# EAGLE design arBot-v1 (EAGLE 7.3.0)
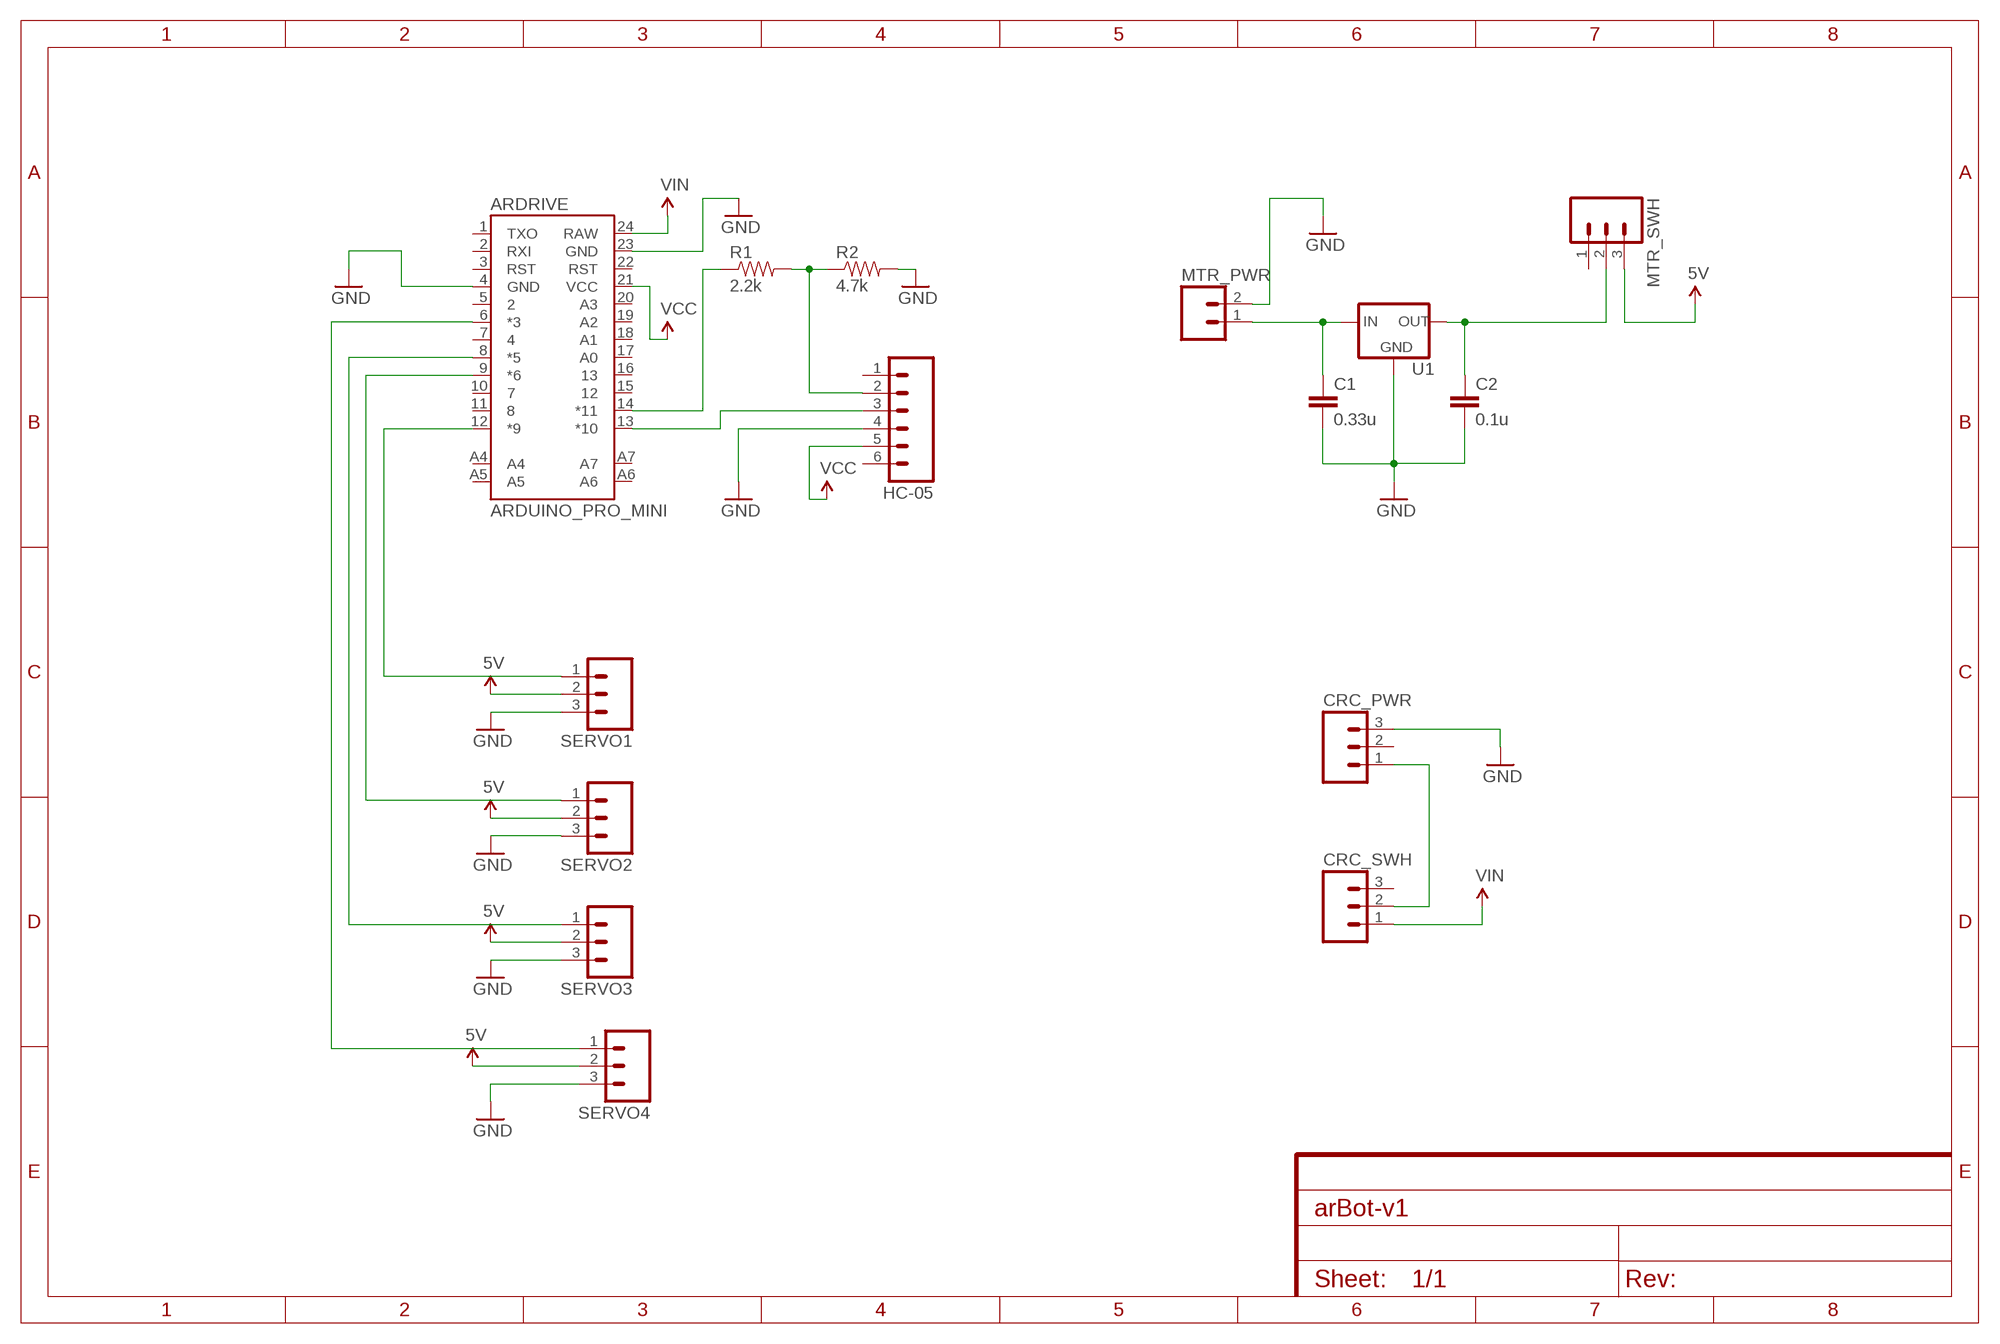
[diagram p0: schematic, sheet 1]

## Parts
ARDRIVE  ARDUINO_PRO_MINI  [ARDUINO_PRO_MINI]
C1  0.33u  CAPPTH  [CAP-PTH-SMALL]
C2  0.1u  CAPPTH  [CAP-PTH-SMALL]
CRC_PWR  M03LONGPADS  [1X03_LONGPADS]
CRC_SWH  M03LOCK_LONGPADS  [1X03_LOCK_LONGPADS]
HC-05  M06LOCK_LONGPADS  [1X06_LOCK_LONGPADS]
MTR_PWR  M025MM  [SCREWTERMINAL-5MM-2]
MTR_SWH  M03-SCREW-5MM  [SCREWTERMINAL-5MM-3]
R1  2.2k  RESISTORKIT  [AXIAL-0.3-KIT]
R2  4.7k  RESISTORKIT  [AXIAL-0.3-KIT]
SERVO1  M03LONGPADS  [1X03_LONGPADS]
SERVO2  M03LONGPADS  [1X03_LONGPADS]
SERVO3  M03LONGPADS  [1X03_LONGPADS]
SERVO4  M03LONGPADS  [1X03_LONGPADS]
U1  V_REG_78XX-TO-220  [TO-220-ALT]

## Nets
5V: MTR_SWH.3 SERVO1.2 SERVO2.2 SERVO3.2 SERVO4.2
GND: ARDRIVE.4(GND) ARDRIVE.23(GND) C1.2 C2.2 CRC_PWR.3 HC-05.4 MTR_PWR.2 R2.P$2 SERVO1.3 SERVO2.3 SERVO3.3 SERVO4.3 U1.GND
N$1: C1.1 MTR_PWR.1 U1.IN
N$2: C2.1 MTR_SWH.2 U1.OUT
N$4: CRC_PWR.1 CRC_SWH.2
N$5: ARDRIVE.13(*10) HC-05.3
N$6: ARDRIVE.14(*11) R1.P$1
N$7: HC-05.2 R1.P$2 R2.P$1
N$8: ARDRIVE.8(*5) SERVO3.1
N$9: ARDRIVE.6(*3) SERVO4.1
N$10: ARDRIVE.9(*6) SERVO2.1
N$11: ARDRIVE.12(*9) SERVO1.1
VCC: ARDRIVE.21(VCC) HC-05.5
VIN: ARDRIVE.24(RAW) CRC_SWH.1
Unconnected: ARDRIVE.1(TXO) ARDRIVE.2(RXI) ARDRIVE.3(RST) ARDRIVE.5 ARDRIVE.7 ARDRIVE.10 ARDRIVE.11 ARDRIVE.15 ARDRIVE.16 ARDRIVE.17(A0) ARDRIVE.18(A1) ARDRIVE.19(A2) ARDRIVE.20(A3) ARDRIVE.22(RST) ARDRIVE.A4 ARDRIVE.A5 ARDRIVE.A6 ARDRIVE.A7 CRC_PWR.2 CRC_SWH.3 HC-05.1 HC-05.6 MTR_SWH.1

## Library data of the parts
ARDRIVE = SparkFun-Boards:ARDUINO_PRO_MINI
C1 C2 = SparkFun-Capacitors:CAP: Capacitor Standard 0603 ceramic capacitor, and 0.1" leaded capacitor.
CRC_PWR CRC_SWH SERVO1-SERVO4 = SparkFun-Connectors:M03: Header 3 Standard 3-pin 0.1" header. Use with straight break away headers (SKU : PRT-00116), right angle break away headers (PRT-00553), swiss pins (PRT-00743), machine pins (PRT-00117), and female headers (PRT-00115). Molex polarized connector foot print use with SKU : PRT-08232 with associated crimp pins and housings.
HC-05 = SparkFun-Connectors:M06: Header 6 Standard 6-pin 0.1" header. Use with straight break away headers (SKU : PRT-00116), right angle break away headers (PRT-00553), swiss pins (PRT-00743), machine pins (PRT-00117), and female headers (PRT-00115). Molex polarized connector foot print use with SKU : PRT-08094 with associated crimp pins and housings. NOTES ON THE VARIANTS LOCK and LOCK_LONGPADS... This footprint was designed to help hold the alignment of a through-hole component (i.e. 6-pin header) while soldering it into place. You may notice that each hole has been shifted either up or down by 0.005 of an inch from it's more standard position (which is a perfectly straight line). This slight alteration caused the pins (the squares in the middle) to touch the edges of the holes. Because they are alternating, it causes a "brace" to hold the component in place. 0.005 has proven to be the perfect amount of "off-center" position when using our standard breakaway headers. Although looks a little odd when you look at the bare footprint, once you have a header in there, the alteration is very hard to notice. Also,if you push a header all the way into place, it is covered up entirely on the bottom side. This idea of altering the position of holes to aid alignment will be further integrated into the Sparkfun Library for other footprints. It can help hold any component with 3 or more connection pins.
MTR_PWR = SparkFun-Connectors:M02: Standard 2-pin 0.1" header. Use with - straight break away headers ( PRT-00116) - right angle break away headers (PRT-00553) - swiss pins (PRT-00743) - machine pins (PRT-00117) - female headers (PRT-00115) Molex polarized connector foot print use with: PRT-08233 with associated crimp pins and housings. 2.54_SCREWTERM for use with PRT-10571. 3.5mm Screw Terminal footprints for PRT-08084 5mm Screw Terminal footprints for use with PRT-08432; STOREFRONT_ID: PRT-08432
MTR_SWH = SparkFun-Connectors:M03: Header 3 Standard 3-pin 0.1" header. Use with straight break away headers (SKU : PRT-00116), right angle break away headers (PRT-00553), swiss pins (PRT-00743), machine pins (PRT-00117), and female headers (PRT-00115). Molex polarized connector foot print use with SKU : PRT-08232 with associated crimp pins and housings.; STOREFRONT_ID: PRT-08433
R1 R2 = SparkFun-Passives:RESISTOR: Resistor Basic schematic elements and footprints for 0603, 1206, and PTH resistors.
U1 = SparkFun-PowerIC:V_REG_78XX: Voltage Regulator Standard 78xx regulator. IGO (Input Ground Output). Spark Fun Electronics SKU : COM-00107; PROD_ID: VREG-08450; SF_ID: COM-00107

## Board
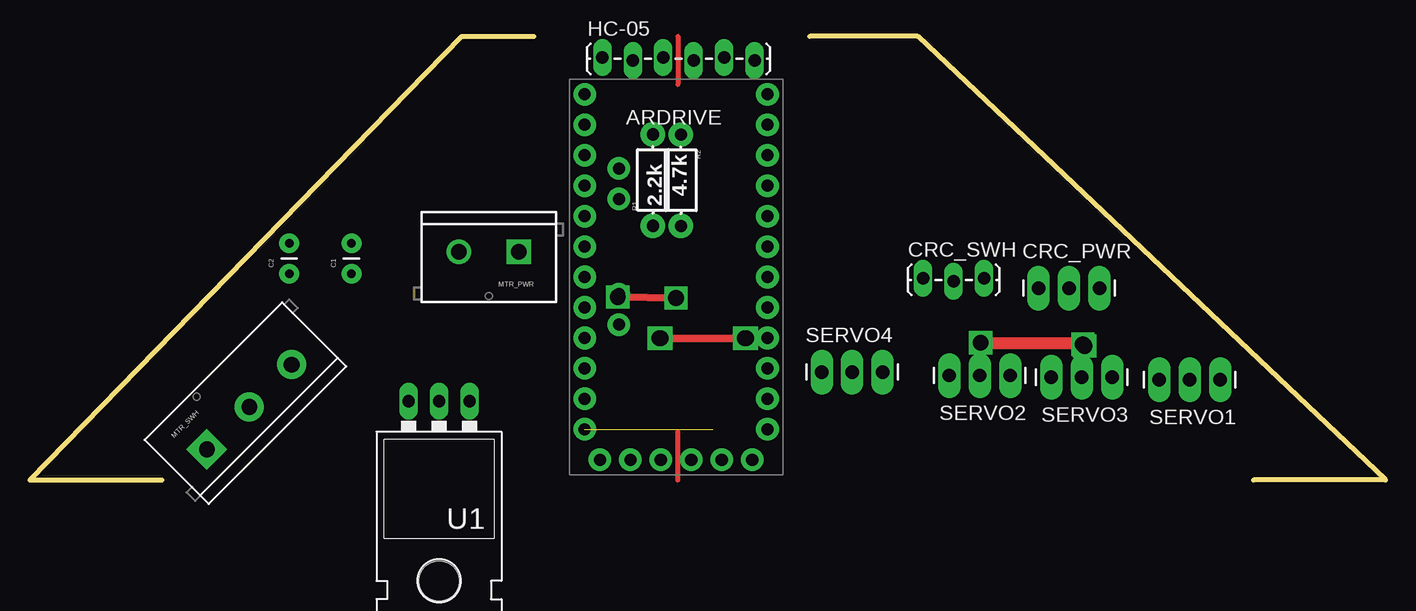
[diagram p1: board, top side]
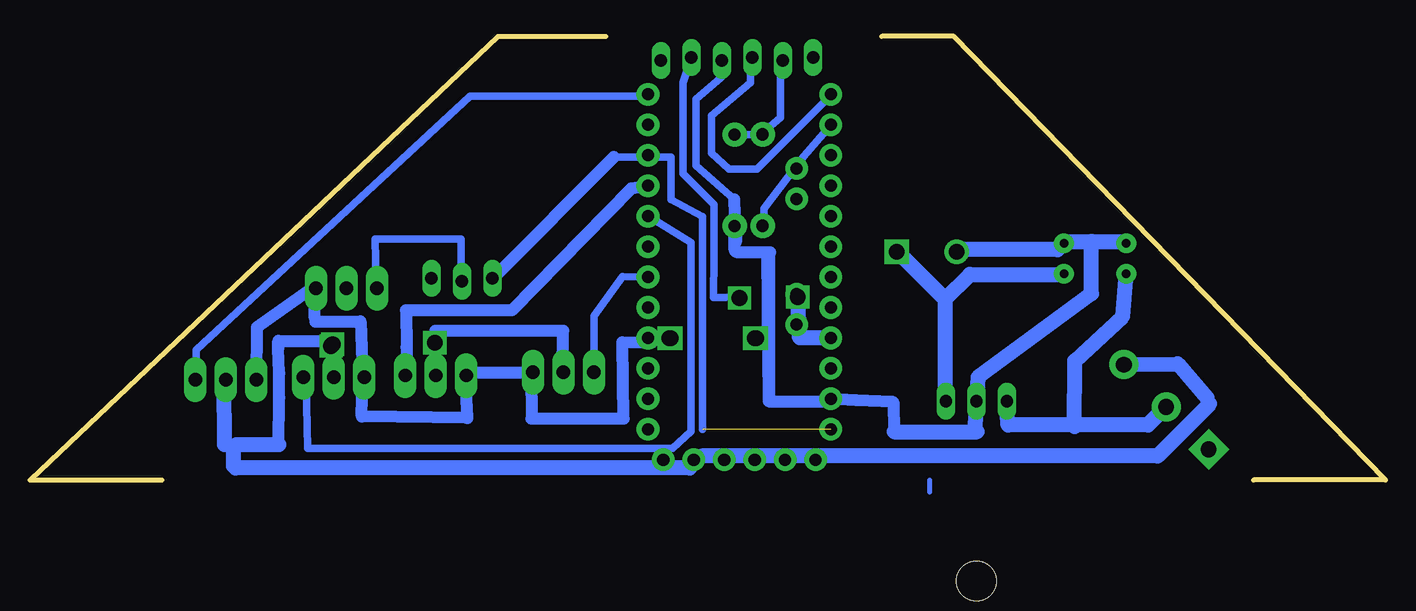
[diagram p2: board, bottom side, seen from below]

Size 113 x 37 mm. Coordinates in mm from the lower left corner, seen from the top.
Outline: 11,0 0,0 36,37 42,37
Outline: 102,0 113,0 74,37 65,37
Copper layers (1*16): Top 0.035mm / dielectric 1.5mm / Bottom 0.035mm
Design rules "default": minimum track width 10mil, minimum drill 24mil, track to track 8mil, track to pad 8mil, pad to pad 8mil, via to via 8mil, smd to smd 8mil, copper to edge 40mil, drill to drill 8mil, minimum pad ring 10mil, minimum via ring 8mil, stop-mask expansion 4mil, vias tented up to drill 0mil, thermal gap 10mil

### Footprints (pad centres in the part's own frame; a part is rotated, then mirrored left to right if it is on the bottom)
ARDUINO_PRO_MINI = drill 1.016 pad 1.88: 1 -7.62,12.7; 2 -7.62,10.16; 3 -7.62,7.62; 4 -7.62,5.08; 5 -7.62,2.54; 6 -7.62,0; 7 -7.62,-2.54; 8 -7.62,-5.08; 9 -7.62,-7.62; 10 -7.62,-10.16; 11 -7.62,-12.7; 12 -7.62,-15.24; 13 7.62,-15.24; 14 7.62,-12.7; 15 7.62,-10.16; 16 7.62,-7.62; 17 7.62,-5.08; 18 7.62,-2.54; 19 7.62,0; 20 7.62,2.54; 21 7.62,5.08; 22 7.62,7.62; 23 7.62,10.16; 24 7.62,12.7; A4 4.763,1.429; A5 4.763,3.969; A6 4.763,-9.049; A7 4.763,-6.509; BLK -6.35,15.24; GND -3.81,15.24; GRN 6.35,15.24; RXI 1.27,15.24; TXO 3.81,15.24; VCC -1.27,15.24
CAP-PTH-SMALL = drill 0.7 pad 1.651: 1 0,0; 2 2.54,0
1X03_LONGPADS = drill 1.118 pad 1.88 long: 1 0,0; 2 2.54,0; 3 5.08,0
1X03_LOCK_LONGPADS = drill 1.016 long: 1 0,0; 2 2.54,-0.254; 3 5.08,0
1X06_LOCK_LONGPADS = drill 1.016 long: 1 0,0; 2 2.54,-0.254; 3 5.08,0; 4 7.62,-0.254; 5 10.16,0; 6 12.7,-0.254
SCREWTERMINAL-5MM-2 = drill 1.3 pad 2.032 square: 1 0,0 | drill 1.3 pad 2.032: 2 5,0
SCREWTERMINAL-5MM-3 = drill 1.3 pad 2.413 square: 1 0,0 | drill 1.3 pad 2.413: 2 5,0; 3 10,0
AXIAL-0.3-KIT = drill 1.016 pad 2.032: P$1 -3.81,0; P$2 3.81,0
TO-220-ALT = drill 1.016 long: GND 0,-3.81; IN -2.54,-3.81; OUT 2.54,-3.81 | hole 3.302: 0,11.176

### Placement (x,y rotation side)
ARDRIVE  53.86,16.92 180 top
C1  26.8,17.2 90 top
C2  21.61,17.2 90 top
CRC_PWR  84.07,16 0 top
CRC_SWH  74.45,16.82 0 top
HC-05  47.71,35.24 0 top
MTR_PWR  40.74,19.04 180 top
MTR_SWH  14.74,2.55 45 top
R1  51.93,25.01 90 top
R2  54.26,24.99 270 top
SERVO1  99.21,8.36 180 top
SERVO2  81.71,8.71 180 top
SERVO3  90.21,8.56 180 top
SERVO4  66,9 0 top
U1  34.1,2.75 180 top

### Tracks (layer width: path | path; a pad name or v marks a point on that pad's centre or on a via)
5V  (via drill 1.3)
  Top 0.61: 87.77,11.43 v87.77,11.3
  Top 1.016: v79.26,11.43 87.77,11.43
  Bottom 0.254: 79.22,10.06 79.1,9.83 | 68.72,9.14 68.6,9.09 | 79.14,8.79 SERVO2.2 | 96.84,8.23 SERVO1.2
  Bottom 0.61: 79.1,9.83 79.14,8.79 | 68.72,9.14 SERVO4.2 | 87.71,10.04 87.77,11.58 87.77,10.05 | 96.81,2.94 95.77,2.94 96.03,2.69 | 87.7,8.69 SERVO3.2 | 17.32,9.68 17.29,9.65 | 14.88,6.86 14.65,6.35 | 57,2 58,1 | 95.89,1 96.03,1.14 | 79.17,11.34 v79.26,11.43
  Bottom 1.016: 79.22,10.06 79.22,12.43 68.55,12.43 68.6,9.09 | 87.7,8.69 87.84,9.83 87.71,10.04 | 87.77,11.58 92.29,11.61 92.3,10.97 92.23,8.91 92.23,6.86 92.27,2.94 | SERVO2.2 79.17,11.34 | v87.77,11.3 87.77,10.05
  Bottom 1.27: 95.77,2.94 92.27,2.94 | 96.84,8.23 96.81,2.94 | MTR_SWH.3 17.32,9.68 | 17.29,9.65 14.88,6.86 | 14.65,6.35 19,2 57,2 | 58,1 95.89,1 | 96.03,1.14 96.03,2.69
GND  (via drill 1.3)
  Top 0.61: v52.47,11.81 v59.71,11.81
  Bottom 0.254: 89.25,15.04 89.13,16 CRC_PWR.3 | 85.18,8.69 SERVO3.3 84.95,8.46 85.27,8.46 | 76.5,8.91 SERVO2.3 76.72,8.69 76.72,8.23 | 61.14,11.47 61.64,11.66 ARDRIVE.4 | 71.24,8.91 SERVO4.3 | 21.63,19.89 C2.2 | 26.66,19.89 C1.2 26.89,19.66 27.35,19.2 | 35.58,19.2 MTR_PWR.2 | 54.19,21.01 R2.P$2
  Bottom 0.61: 89.22,13.21 89.42,13.59 89.3,13.59 89.39,16.06 | 63.6,11.43 63.61,11.5 | 34.03,4.01 34.2,4.34 | 54.28,23.39 57.46,26.2 57.46,31.74 55.39,33.53 55.39,34.92 HC-05.4 | 46.32,6.54 46.32,6.86 | 51.55,18.74 51.2,19.05 arc90 51.25,19 51.27,19 51.2,18.92 | 54,19 54.26,19.26 54.12,19.05 51.2,18.92 | 51.2,11.81 51.2,6.73 50.94,6.48 46.52,6.48 ARDRIVE.23 | 51.2,18.92 51.2,11.81 | 51.2,11.81 v52.47,11.81 | v59.71,11.81 ARDRIVE.4
  Bottom 1.016: 85.18,8.69 85.33,9.83 85.45,13.22 89.22,13.21 | 89.25,15.04 89.3,13.59 | 89.39,16.06 94.1,12.73 SERVO1.3 | 76.5,8.91 71.24,8.91 71.2,5.13 63.52,5.13 63.6,11.43 | 63.61,11.5 61.14,11.47 | 85.27,8.46 85.34,5.29 76.55,5.16 76.72,8.23 | 40.98,4.01 41.03,6.5 44.13,6.63 ARDRIVE.23 | 54.28,23.39 54.15,19.82 54.19,21.01 | 46.32,6.54 51.42,6.56 51.55,18.74 | R2.P$2 54.26,19.26 arc-90 54,19 51.27,19
  Bottom 1.27: 26.66,19.89 24.52,19.89 | 24.52,19.89 21.63,19.89 | 27.35,19.2 35.58,19.2 | 40.98,4.01 34.03,4.01 | 34.2,4.34 U1.GND 33.98,8.57 24.52,15.53 24.52,19.89
N$1
  Bottom 0.254: 40.6,18.97 MTR_PWR.1 | 26.89,17.14 C1.1
  Bottom 0.61: 36.72,6.57 U1.IN
  Bottom 1.27: 36.72,15.09 36.72,6.57 | 40.6,18.97 36.72,15.09 | 26.89,17.14 34.66,17.14 36.72,15.09
N$2
  Bottom 0.254: 18.43,5.94 MTR_SWH.2
  Bottom 0.61: 25.93,4.46 19.83,4.43 MTR_SWH.2
  Bottom 1.27: 18.43,5.94 19.8,4.57 31.46,4.57 U1.OUT | 25.93,4.46 25.9,9.93 21.9,13.64 C2.1
N$3
  Top 0.406: 54,0 54,4
N$4
  Bottom 0.254: 84.1,14.86 CRC_PWR.1
  Bottom 0.61: 84.1,14.86 84.22,20.11 77.05,20.11 77.06,18.37 CRC_SWH.2
N$5
  Bottom 0.254: 52.95,35.2 HC-05.3 | 46.32,32 ARDRIVE.13
  Bottom 0.61: 52.95,35.2 52.95,33.12 56.19,30.37 56.19,27.25 54.74,25.93 52.39,25.93 46.32,32
N$6
  Bottom 0.254: 46.32,29.49 ARDRIVE.14 | 51.81,21.26 R1.P$1
  Bottom 0.61: 46.32,29.49 48.46,26.99 51.81,22.65 51.81,21.26
N$7
  Bottom 0.254: 50.44,34.98 HC-05.2 | 51.81,29.03 R1.P$2 52.03,28.8 | 54.09,28.8 R2.P$1
  Bottom 0.61: 50.44,34.98 50.44,35.02 50.44,30.23 51.81,29.03 | 52.03,28.8 54.09,28.8
N$8
  Bottom 0.254: 61.41,21.95 ARDRIVE.8
  Bottom 0.61: 61.41,21.95 57.9,19.81 57.9,4.04 59.44,2.62 89.85,2.62 89.98,8 89.98,8.46 SERVO3.1
N$9
  Bottom 0.254: 61.64,16.92 ARDRIVE.6 | 65.98,9.14 SERVO4.1
  Bottom 0.61: 61.64,16.92 63.62,16.97 65.98,13.66 65.98,9.14
N$10
  Bottom 0.254: 81.78,8.79 SERVO2.1
  Bottom 1.016: 81.78,8.79 81.61,9.83 81.61,11.06 81.66,14.15 72.85,14.15 62.87,24.33 ARDRIVE.9
N$11
  Bottom 0.254: 99.13,8.46 SERVO1.1 | 61.64,32 ARDRIVE.12
  Bottom 0.61: 99.13,8.46 99.13,10.82 76.29,32 61.64,32
N$12
  Top 0.406: 54,37 54,33
N$13  (via drill 1.3)
  other vias: 52.59,11.81
N$14  (via drill 1.3)
  other vias: 59.58,11.81
N$15
  Bottom 0.406: 38,-1 38,0
N$17  (via drill 1.3)
  other vias: 87.9,11.18
N$18
  Bottom 0.61: 87.62,8.51 87.65,8.51
N$20
  Bottom 0.61: 74.44,16.89 74.31,16.76
VCC  (via drill 1.3)
  Top 0.61: v49,15.25 v53.86,15.17
  Bottom 0.61: v53.86,15.17 53.98,15.25 55.03,15.22 56.02,15.22 56,18.64 56,22.96 58.56,25.53 58.56,33.14 | 58.56,33.14 57.93,35.05 57.93,34.93 | 57.93,34.54 57.93,34.93 | 57.93,34.93 58,35 | HC-05.5 58.56,33.14
  Bottom 1.27: ARDRIVE.21 48.84,11.84 v49,15.25
VIN  (1 unrouted)
  Bottom 0.61: 56.94,4.22 56.93,16.38 56.93,21.97 59.58,23.37 59.58,26.92 64.35,26.92
  Bottom 1.016: 64.35,26.92 CRC_SWH.1